# Altium project rcan_usb.PrjPcb
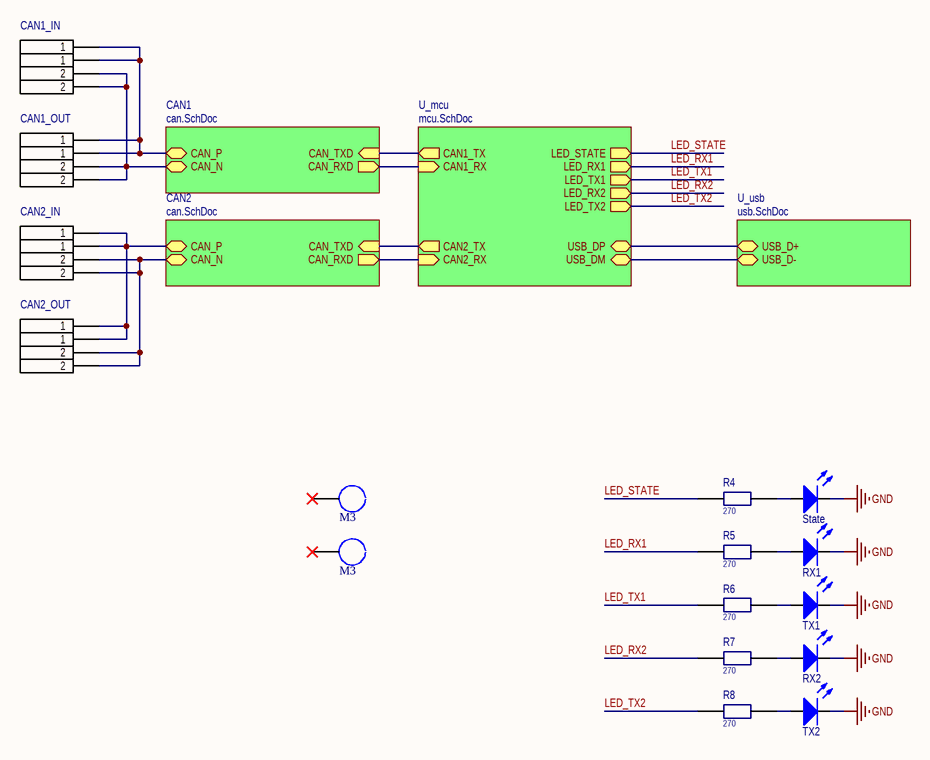
[diagram p0: scheme.SchDoc]
4 sheets, 52 parts. Net scope: hierarchical (ports join the sheet entries above them; power ports are global).
Board file: PCB.PcbDoc
Sheets:
  scheme.SchDoc
    U_mcu = mcu.SchDoc
    CAN1 = can.SchDoc
    U_usb = usb.SchDoc
    CAN2 = can.SchDoc

## Sheet scheme.SchDoc: {Наименование}
size 209 x 297 mm; DocumentNumber: {Обозначение}; SheetNumber: 1; SheetTotal: 4; PageSetup: Record=PageOptions|CenterHorizontal=False|CenterVertical=False|PrintScale=0.95|XCorrection=0.00|YCorrection=0.00|PrintKind=1|BorderSize=5000000|LeftOffset=0|BottomOffset=0|Orientation=1|PaperLength=1000|PaperWidth=1000|Scale=100|PaperSource=15|PrintQuality=600|MediaType=1|DitherType=10|PaperKind=A4|PrintScaleMode=1; Rule: PcbType=ProtelPcb

### Parts
*1  M3  [M3]  (no BOM)
*2  M3  [M3]  (no BOM)
CAN1_IN  TBLH10-350-02BK  [CUI_TBLH10-350-02BK]  (value not drawn)
CAN1_OUT  TBLH10-350-02BK  [CUI_TBLH10-350-02BK]  (value not drawn)
CAN2_IN  TBLH10-350-02BK  [CUI_TBLH10-350-02BK]  (value not drawn)
CAN2_OUT  TBLH10-350-02BK  [CUI_TBLH10-350-02BK]  (value not drawn)
R4  270  [R_0603]
R5  270  [R_0603]
R6  270  [R_0603]
R7  270  [R_0603]
R8  270  [R_0603]
RX1  Red  [LED_0603]  (value not drawn)
RX2  Red  [LED_0603]  (value not drawn)
State  Red  [LED_0603]  (value not drawn)
TX1  Red  [LED_0603]  (value not drawn)
TX2  Red  [LED_0603]  (value not drawn)

### Sub-sheets
CAN1 = can.SchDoc: CAN_RXD (out), CAN_TXD (in), CAN_P (bidir), CAN_N (bidir)
CAN2 = can.SchDoc: CAN_RXD (out), CAN_TXD (in), CAN_P (bidir), CAN_N (bidir)
U_mcu = mcu.SchDoc: LED_STATE (out), LED_RX1 (out), LED_TX1 (out), LED_RX2 (out), LED_TX2 (out), USB_DP (bidir), USB_DM (bidir), CAN1_RX (in), CAN1_TX (out), CAN2_RX (in), CAN2_TX (out)
U_usb = usb.SchDoc: USB_D+ (bidir), USB_D- (bidir)

### Nets
GND: RX1.2(K) RX2.2(K) State.2(K) TX1.2(K) TX2.2(K)
CAN_N: CAN1_IN.2_A(2) CAN1_IN.2_B(2) CAN1_OUT.2_A(2) CAN1_OUT.2_B(2) ; sheet CAN1/CAN_N
CAN_N: CAN2_IN.2_A(2) CAN2_IN.2_B(2) CAN2_OUT.2_A(2) CAN2_OUT.2_B(2) ; sheet CAN2/CAN_N  [a separate net that carries the same name]
CAN_P: CAN1_IN.1_A(1) CAN1_IN.1_B(1) CAN1_OUT.1_A(1) CAN1_OUT.1_B(1) ; sheet CAN1/CAN_P
CAN_P: CAN2_IN.1_A(1) CAN2_IN.1_B(1) CAN2_OUT.1_A(1) CAN2_OUT.1_B(1) ; sheet CAN2/CAN_P  [a separate net that carries the same name]
LED_RX1: R5.2 ; sheet U_mcu/LED_RX1
LED_RX2: R7.2 ; sheet U_mcu/LED_RX2
LED_STATE: R4.2 ; sheet U_mcu/LED_STATE
LED_TX1: R6.2 ; sheet U_mcu/LED_TX1
LED_TX2: R8.2 ; sheet U_mcu/LED_TX2
USB_CONN_D_N: sheet U_mcu/USB_DM, sheet U_usb/USB_D-
USB_CONN_D_P: sheet U_mcu/USB_DP, sheet U_usb/USB_D+
NetR4_1: R4.1 State.1(A)
NetR5_1: R5.1 RX1.1(A)
NetR6_1: R6.1 TX1.1(A)
NetR7_1: R7.1 RX2.1(A)
NetR8_1: R8.1 TX2.1(A)
NetU1_57: sheet U_mcu/CAN2_RX, sheet CAN2/CAN_RXD
NetU1_58: sheet U_mcu/CAN2_TX, sheet CAN2/CAN_TXD
NetU1_61: sheet U_mcu/CAN1_RX, sheet CAN1/CAN_RXD
NetU1_62: sheet U_mcu/CAN1_TX, sheet CAN1/CAN_TXD

Not connected (* = marked no-connect by the designer): *1 1*; *2 1*

### Notes on the sheet
- Подп. и дата
- Инв. № дубл.
- Взам. инв. №
- Инв. № подл.
- Лист
- Изм.
- № докум.
- Подп.
- Дата

### Library data of the parts
CAN1_IN = TBLH10-350-02BK: Alternative Part: JILN JL212R-35002B01; Package: None; Part Number: TBLH10-350-02BK; Price: None; Value: *; Availability: Unavailable
R4-R8 = RES_SMD: Resistor; Part Number: RC0603FR-07270RL; Alternative Part: *; Value: 270
RX1 RX2 = LED_SMT_0603: LED; Part Number: GNL-0603SGC; Value: *; Color: Red
State = LED_SMT_0603: LED; Part Number: GNL-0603SRC; Value: *; Color: Red
TX1 TX2 = LED_SMT_0603: LED; Part Number: GNL-0603SBC; Value: *; Color: Red
CAN1_OUT CAN2_IN CAN2_OUT = TBLH10-350-02BK: Package: None; Part Number: TBLH10-350-02BK; Price: None; Value: *; Availability: Unavailable; Alternative Part: *

## Sheet mcu.SchDoc: {Наименование}
size 209 x 297 mm; DocumentNumber: {Обозначение}; SheetNumber: 2; SheetTotal: 4; PageSetup: Record=PageOptions|CenterHorizontal=False|CenterVertical=False|PrintScale=0.95|XCorrection=0.00|YCorrection=0.00|PrintKind=1|BorderSize=5000000|LeftOffset=0|BottomOffset=0|Orientation=1|PaperLength=1000|PaperWidth=1000|Scale=100|PaperSource=15|PrintQuality=600|MediaType=1|DitherType=10|PaperKind=A4|PrintScaleMode=1; Rule: PcbType=ProtelPcb
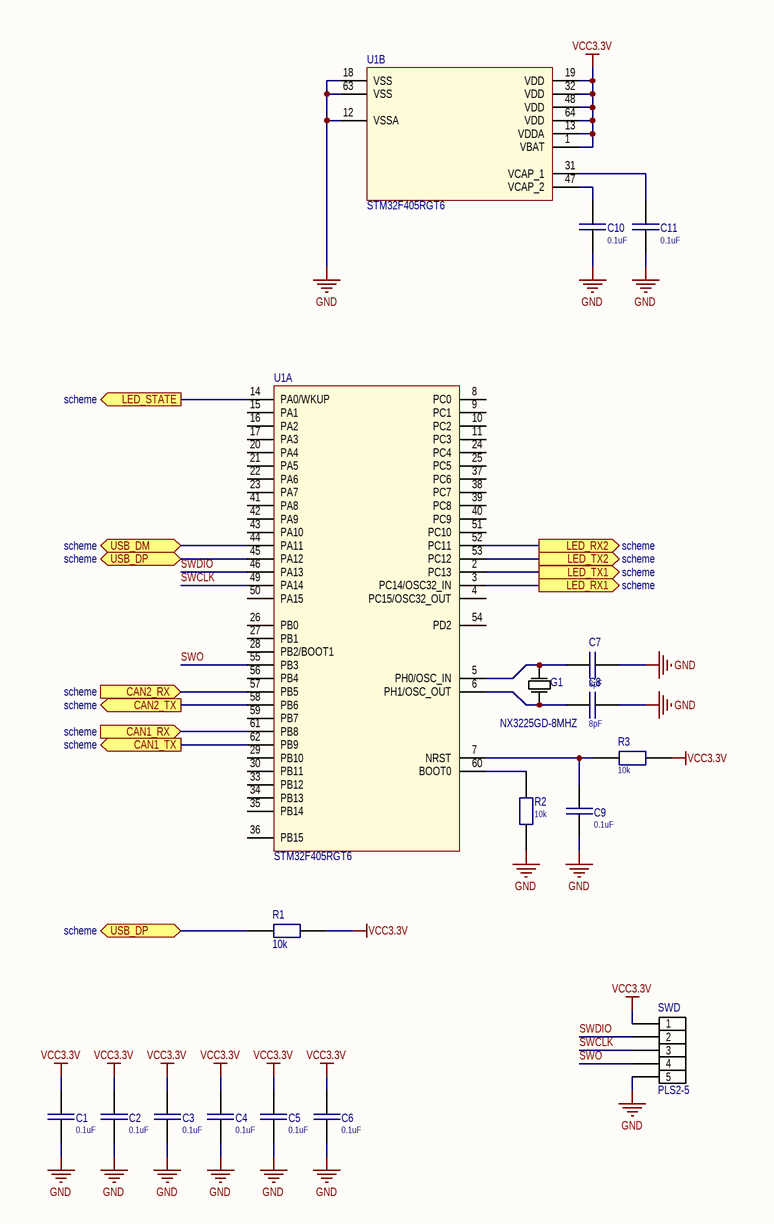
[diagram p1: mcu.SchDoc]

### Parts
C1  0.1uF  [C_0603]
C2  0.1uF  [C_0603]
C3  0.1uF  [C_0603]
C4  0.1uF  [C_0603]
C5  0.1uF  [C_0603]
C6  0.1uF  [C_0603]
C7  8pF  [C_0603]
C8  8pF  [C_0603]
C9  0.1uF  [C_0603]
C10  0.1uF  [C_0603]
C11  0.1uF  [C_0603]
G1  NX3225GD-8MHZ  [NX3225GD]
R1  10k  [R_0603]
R2  10k  [R_0603]
R3  10k  [R_0603]
SWD  PLS2-5  [PLS-5-3D]  (net tie, no BOM)
U1  STM32F405RGT6  [LQFP64-10x10mm]  (parts A,B of 2)

### Ports
CAN1_RX (in, see scheme), CAN1_TX (out, see scheme), CAN2_RX (in, see scheme), CAN2_TX (out, see scheme), LED_RX1 (out, see scheme), LED_RX2 (out, see scheme), LED_STATE (out, see scheme), LED_TX1 (out, see scheme), LED_TX2 (out, see scheme), USB_DM (bidir, see scheme), USB_DP (bidir, see scheme)

### Nets
GND: C1.1 C2.1 C3.1 C4.1 C5.1 C6.1 C7.1 C8.1 C9.1 C10.1 C11.1 R2.1 SWD.5 U1.12(VSSA) U1.18(VSS) U1.63(VSS)
VCC3.3V: C1.2 C2.2 C3.2 C4.2 C5.2 C6.2 R1.1 R3.2 SWD.1 U1.1(VBAT) U1.13(VDDA) U1.19(VDD) U1.32(VDD) U1.48(VDD) U1.64(VDD)
LED_RX1: U1.3(PC14/OSC32_IN) ; port LED_RX1
LED_RX2: U1.52(PC11) ; port LED_RX2
LED_STATE: U1.14(PA0/WKUP) ; port LED_STATE
LED_TX1: U1.2(PC13) ; port LED_TX1
LED_TX2: U1.53(PC12) ; port LED_TX2
SWCLK: SWD.3 U1.49(PA14)
SWDIO: SWD.2 U1.46(PA13)
SWO: SWD.4 U1.55(PB3)
USB_CONN_D_N: U1.44(PA11) ; port USB_DM
USB_CONN_D_P: R1.2 U1.45(PA12) ; port USB_DP
NetC7_2: C7.2 G1.2(OSC2) U1.5(PH0/OSC_IN)
NetC8_2: C8.2 G1.1(OSC1) U1.6(PH1/OSC_OUT)
NetC9_2: C9.2 R3.1 U1.7(NRST)
NetC10_2: C10.2 U1.47(VCAP_2)
NetC11_2: C11.2 U1.31(VCAP_1)
NetR2_2: R2.2 U1.60(BOOT0)
NetU1_57: U1.57(PB5) ; port CAN2_RX
NetU1_58: U1.58(PB6) ; port CAN2_TX
NetU1_61: U1.61(PB8) ; port CAN1_RX
NetU1_62: U1.62(PB9) ; port CAN1_TX

Not connected (* = marked no-connect by the designer): U1 4(PC15/OSC32_OUT) 8(PC0) 9(PC1) 10(PC2) 11(PC3) 15(PA1) 16(PA2) 17(PA3) 20(PA4) 21(PA5) 22(PA6) 23(PA7) 24(PC4) 25(PC5) 26(PB0) 27(PB1) 28(PB2/BOOT1) 29(PB10) 30(PB11) 33(PB12) 34(PB13) 35(PB14) 36(PB15) 37(PC6) 38(PC7) 39(PC8) 40(PC9) 41(PA8) 42(PA9) 43(PA10) 50(PA15) 51(PC10) 54(PD2) 56(PB4) 59(PB7)

### Notes on the sheet
- Подп. и дата
- Инв. № дубл.
- Взам. инв. №
- Инв. № подл.
- Лист
- Изм.
- № докум.
- Подп.
- Дата

### Library data of the parts
C1-C6 C9-C11 = CAP_SMD: Capacitor; Part Number: CC0603KPX7R9BB104; Alternative Part: *; Value: 0.1uF
C7 C8 = CAP_SMD: Capacitor; Part Number: CC0603DRNPO9BN8R0; Alternative Part: *; Value: 8pF
G1 = NX3225GD: Crystal Oscillator; Part Number: NX3225GD-8MHZ-EXS00A-CG05041; Alternative Part: *
R1-R3 = RES_SMD: Resistor; Part Number: RC0603FR-0710KL; Alternative Part: *; Value: 10k
SWD = PLS2-5: Header, 5-Pin; Part Number: PLS-5; LatestRevisionDate: 17-Jul-2002; LatestRevisionNote: Re-released for DXP Platform.; Publisher: Altium Limited
U1 = STM32F405RGT6: No Description Available; Mfr_Name: STMicroelectronics; Copyright: Copyright (C) 2022 Ultra Librarian. All rights reserved.; Manufacturer_Part_Number: STM32F405RGT6; RefDes: RefDes; Type: DEV; Part Number: STM32F405RGT6

## Sheet can.SchDoc: {Наименование}
size 209 x 297 mm; DocumentNumber: {Обозначение}; SheetNumber: 3; SheetTotal: 4; PageSetup: Record=PageOptions|CenterHorizontal=False|CenterVertical=False|PrintScale=0.95|XCorrection=0.00|YCorrection=0.00|PrintKind=1|BorderSize=5000000|LeftOffset=0|BottomOffset=0|Orientation=1|PaperLength=1000|PaperWidth=1000|Scale=100|PaperSource=15|PrintQuality=600|MediaType=1|DitherType=10|PaperKind=A4|PrintScaleMode=1; Rule: PcbType=ProtelPcb
Used 2 times, as channels CAN1, CAN2. Parts and nets are listed once, with the designators drawn on the sheet.
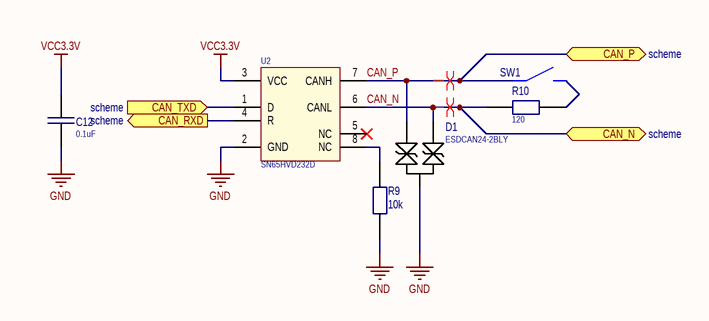
[diagram p2: can.SchDoc]

### Parts
C12  0.1uF  [C_0603]
D1  ESDCAN24-2BLY  [SOT23]
R9  10k  [R_0603]
R10  120  [R_0603]
SW1  DS1040-01RT  [DS1040-01RT]  (value not drawn)
U2  SN65HVD232D  [SO-8_M]

### Ports
CAN_N (bidir, see scheme), CAN_P (bidir, see scheme), CAN_RXD (out, see scheme), CAN_TXD (in, see scheme)

### Nets
GND: C12.1 D1.3 R9.2 U2.2(GND)
VCC3.3V: C12.2 U2.3(VCC)
CAN_N: D1.2 R10.2 U2.6(CANL) ; port CAN_N
CAN_P: D1.1 SW1.1 U2.7(CANH) ; port CAN_P
CAN_RXD: U2.4(R) ; port CAN_RXD
CAN_TXD: U2.1(D) ; port CAN_TXD
NetR9_1: R9.1 U2.8(NC)
NetR10_1: R10.1 SW1.2

Not connected (* = marked no-connect by the designer): U2 5(NC)*

### Channels
CAN1: designators end in _CAN1; ports CAN_N=CAN_N CAN_P=CAN_P CAN_RXD=NetU1_61 CAN_TXD=NetU1_62
CAN2: designators end in _CAN2; ports CAN_N=CAN_N CAN_P=CAN_P CAN_RXD=NetU1_57 CAN_TXD=NetU1_58

### Layout directives
differential pair: CAN_N, CAN_P

### Notes on the sheet
- Подп. и дата
- Инв. № дубл.
- Взам. инв. №
- Инв. № подл.
- Лист
- Изм.
- № докум.
- Подп.
- Дата

### Library data of the parts
C12 = CAP_SMD: as C1 on sheet mcu; Alternative Part: *; Value: 0.1uF
D1 = ESD_CAN: ESD; Value: ESDCAN24-2BLY; Part Number: ESDCAN24-2BLY; Alternative Part: *
R9 = RES_SMD: Resistor; Part Number: RC0603FR-0710KL; Alternative Part: *; Value: 10k
R10 = RES_SMD: Resistor; Part Number: RC0603FR-07120RL; Alternative Part: *; Value: 120
SW1 = button_dip
U2 = SN65HVD232D: CAN_transiever; Part Number: SN65HVD232D

## Sheet usb.SchDoc: {Наименование}
size 209 x 297 mm; DocumentNumber: {Обозначение}; SheetNumber: 4; SheetTotal: 4; PageSetup: Record=PageOptions|CenterHorizontal=False|CenterVertical=False|PrintScale=0.95|XCorrection=0.00|YCorrection=0.00|PrintKind=1|BorderSize=5000000|LeftOffset=0|BottomOffset=0|Orientation=1|PaperLength=1000|PaperWidth=1000|Scale=100|PaperSource=15|PrintQuality=600|MediaType=1|DitherType=10|PaperKind=A4|PrintScaleMode=1; Rule: PcbType=ProtelPcb
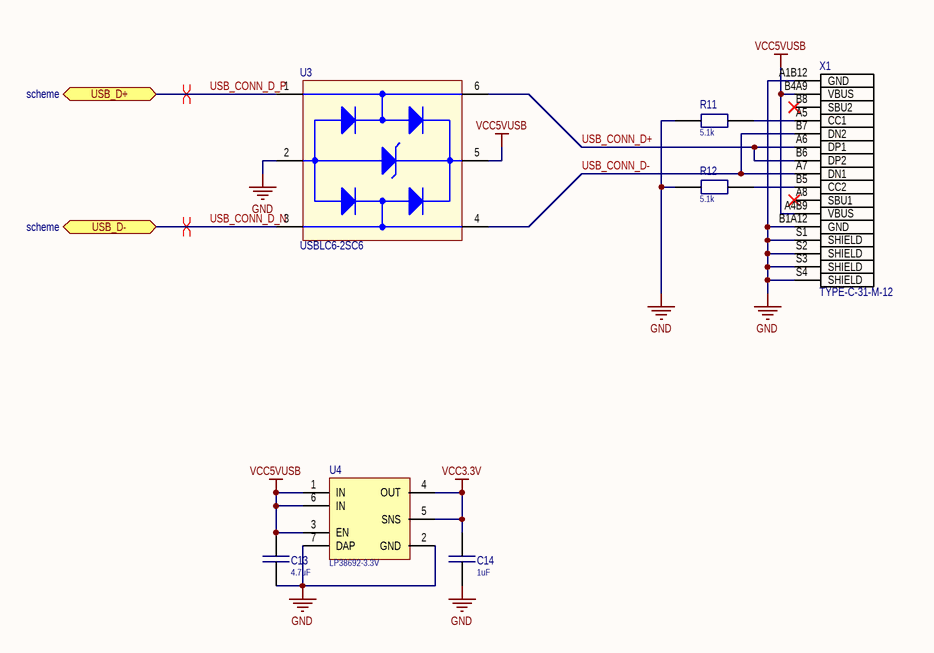
[diagram p3: usb.SchDoc]

### Parts
C13  4.7uF  [C_0603]
C14  1uF  [C_0603]
R11  5.1k  [R_0603]
R12  5.1k  [R_0603]
U3  USBLC6-2SC6  [SOT95P280X145-6N]
U4  LP38692-3.3V  [WSON-6]
X1  TYPE-C-31-M-12  [HRO_TYPE-C-31-M-12]

### Ports
USB_D+ (bidir, see scheme), USB_D- (bidir, see scheme)

### Nets
GND: C13.1 C14.1 R11.1 R12.1 U3.2(GND) U4.2(GND) U4.7(DAP) X1.A1B12(GND) X1.B1A12(GND) X1.S1(SHIELD) X1.S2(SHIELD) X1.S3(SHIELD) X1.S4(SHIELD)
VCC3.3V: C14.2 U4.4(OUT) U4.5(SNS)
VCC5VUSB: C13.2 U3.5(VBUS) U4.1(IN) U4.3(EN) U4.6(IN) X1.A4B9(VBUS) X1.B4A9(VBUS)
USB_CONN_D+: U3.6(I/O1_OUT) X1.A6(DP1) X1.B6(DP2)
USB_CONN_D-: U3.4(I/O2_OUT) X1.A7(DN1) X1.B7(DN2)
USB_CONN_D_N: U3.3(I/O2_IN) ; port USB_D-
USB_CONN_D_P: U3.1(I/O1_IN) ; port USB_D+
NetR11_2: R11.2 X1.A5(CC1)
NetR12_2: R12.2 X1.B5(CC2)

Not connected (* = marked no-connect by the designer): X1 A8(SBU1)* B8(SBU2)*

### Layout directives
differential pair: USB_CONN_D_N, USB_CONN_D_P

### Notes on the sheet
- Подп. и дата
- Инв. № дубл.
- Взам. инв. №
- Инв. № подл.
- Лист
- Изм.
- № докум.
- Подп.
- Дата

### Library data of the parts
C13 = CAP_SMD: Capacitor; Part Number: CC0603KRX5R6BB475; Alternative Part: *; Value: 4.7uF
C14 = CAP_SMD: Capacitor; Part Number: CC0603ZRY5V7BB105; Alternative Part: *; Value: 1uF
R11 R12 = RES_SMD: Resistor; Part Number: RC0603FR-075K1L; Alternative Part: *; Value: 5.1k
U3 = USBLC6-2SC6: 17V Clamp 5A (8/20Âµs) Ipp Tvs Diode Surface Mount SOT-23-6; MF: STMicroelectronics; Value: *; Check_prices: https://www.snapeda.com/parts/USBLC6-2SC6/STMicroelectronics/view-part/?ref=eda; MP: USBLC6-2SC6; Purchase-URL: https://pricing.snapeda.com/search/part/USBLC6-2SC6/?ref=eda; Price: None; Availability: In Stock; Package: SOT-23-6 STMicroelectronics; SnapEDA_Link: https://www.snapeda.com/parts/USBLC6-2SC6/STMicroelectronics/view-part/?ref=snap; Part Number: USBLC6-2SC6; Alternative Part: *
U4 = LP38692: LP38690, LP38692 1-A LDO CMOS Linear Regulators  Stable with Ceramic Output Capacitors
X1 = TYPE-C-31-M-12: USB Connectors 24 Receptacle 1 8.94*7.3mm RoHS; Package: None; Availability: Unavailable; Value: *; MP: TYPE-C-31-M-12; Price: None; System: Connector; Part Number: TYPE-C-31-M-12

## Nets that join several sheets
GND: scheme (5 pins), mcu (16 pins), CAN1 (C12_CAN1.1 D1_CAN1.3 R9_CAN1.2 U2_CAN1.2), usb (13 pins), CAN2 (C12_CAN2.1 D1_CAN2.3 R9_CAN2.2 U2_CAN2.2)
VCC3.3V: mcu (15 pins), CAN1 (C12_CAN1.2 U2_CAN1.3), usb (C14.2 U4.4 U4.5), CAN2 (C12_CAN2.2 U2_CAN2.3)
CAN_N: scheme (CAN1_IN.2_A CAN1_IN.2_B CAN1_OUT.2_A CAN1_OUT.2_B), CAN1 (D1_CAN1.2 R10_CAN1.2 U2_CAN1.6)
CAN_N: scheme (CAN2_IN.2_A CAN2_IN.2_B CAN2_OUT.2_A CAN2_OUT.2_B), CAN2 (D1_CAN2.2 R10_CAN2.2 U2_CAN2.6)
CAN_P: scheme (CAN1_IN.1_A CAN1_IN.1_B CAN1_OUT.1_A CAN1_OUT.1_B), CAN1 (D1_CAN1.1 SW1_CAN1.1 U2_CAN1.7)
CAN_P: scheme (CAN2_IN.1_A CAN2_IN.1_B CAN2_OUT.1_A CAN2_OUT.1_B), CAN2 (D1_CAN2.1 SW1_CAN2.1 U2_CAN2.7)
LED_RX1: scheme (R5.2), mcu (U1.3)
LED_RX2: scheme (R7.2), mcu (U1.52)
LED_STATE: scheme (R4.2), mcu (U1.14)
LED_TX1: scheme (R6.2), mcu (U1.2)
LED_TX2: scheme (R8.2), mcu (U1.53)
NetU1_57: mcu (U1.57), CAN2 (U2_CAN2.4)
NetU1_58: mcu (U1.58), CAN2 (U2_CAN2.1)
NetU1_61: mcu (U1.61), CAN1 (U2_CAN1.4)
NetU1_62: mcu (U1.62), CAN1 (U2_CAN1.1)
USB_CONN_D_N: mcu (U1.44), usb (U3.3)
USB_CONN_D_P: mcu (R1.2 U1.45), usb (U3.1)